# EAGLE design mc6809e_adapter (EAGLE 5.12)
REVISION: 20120726
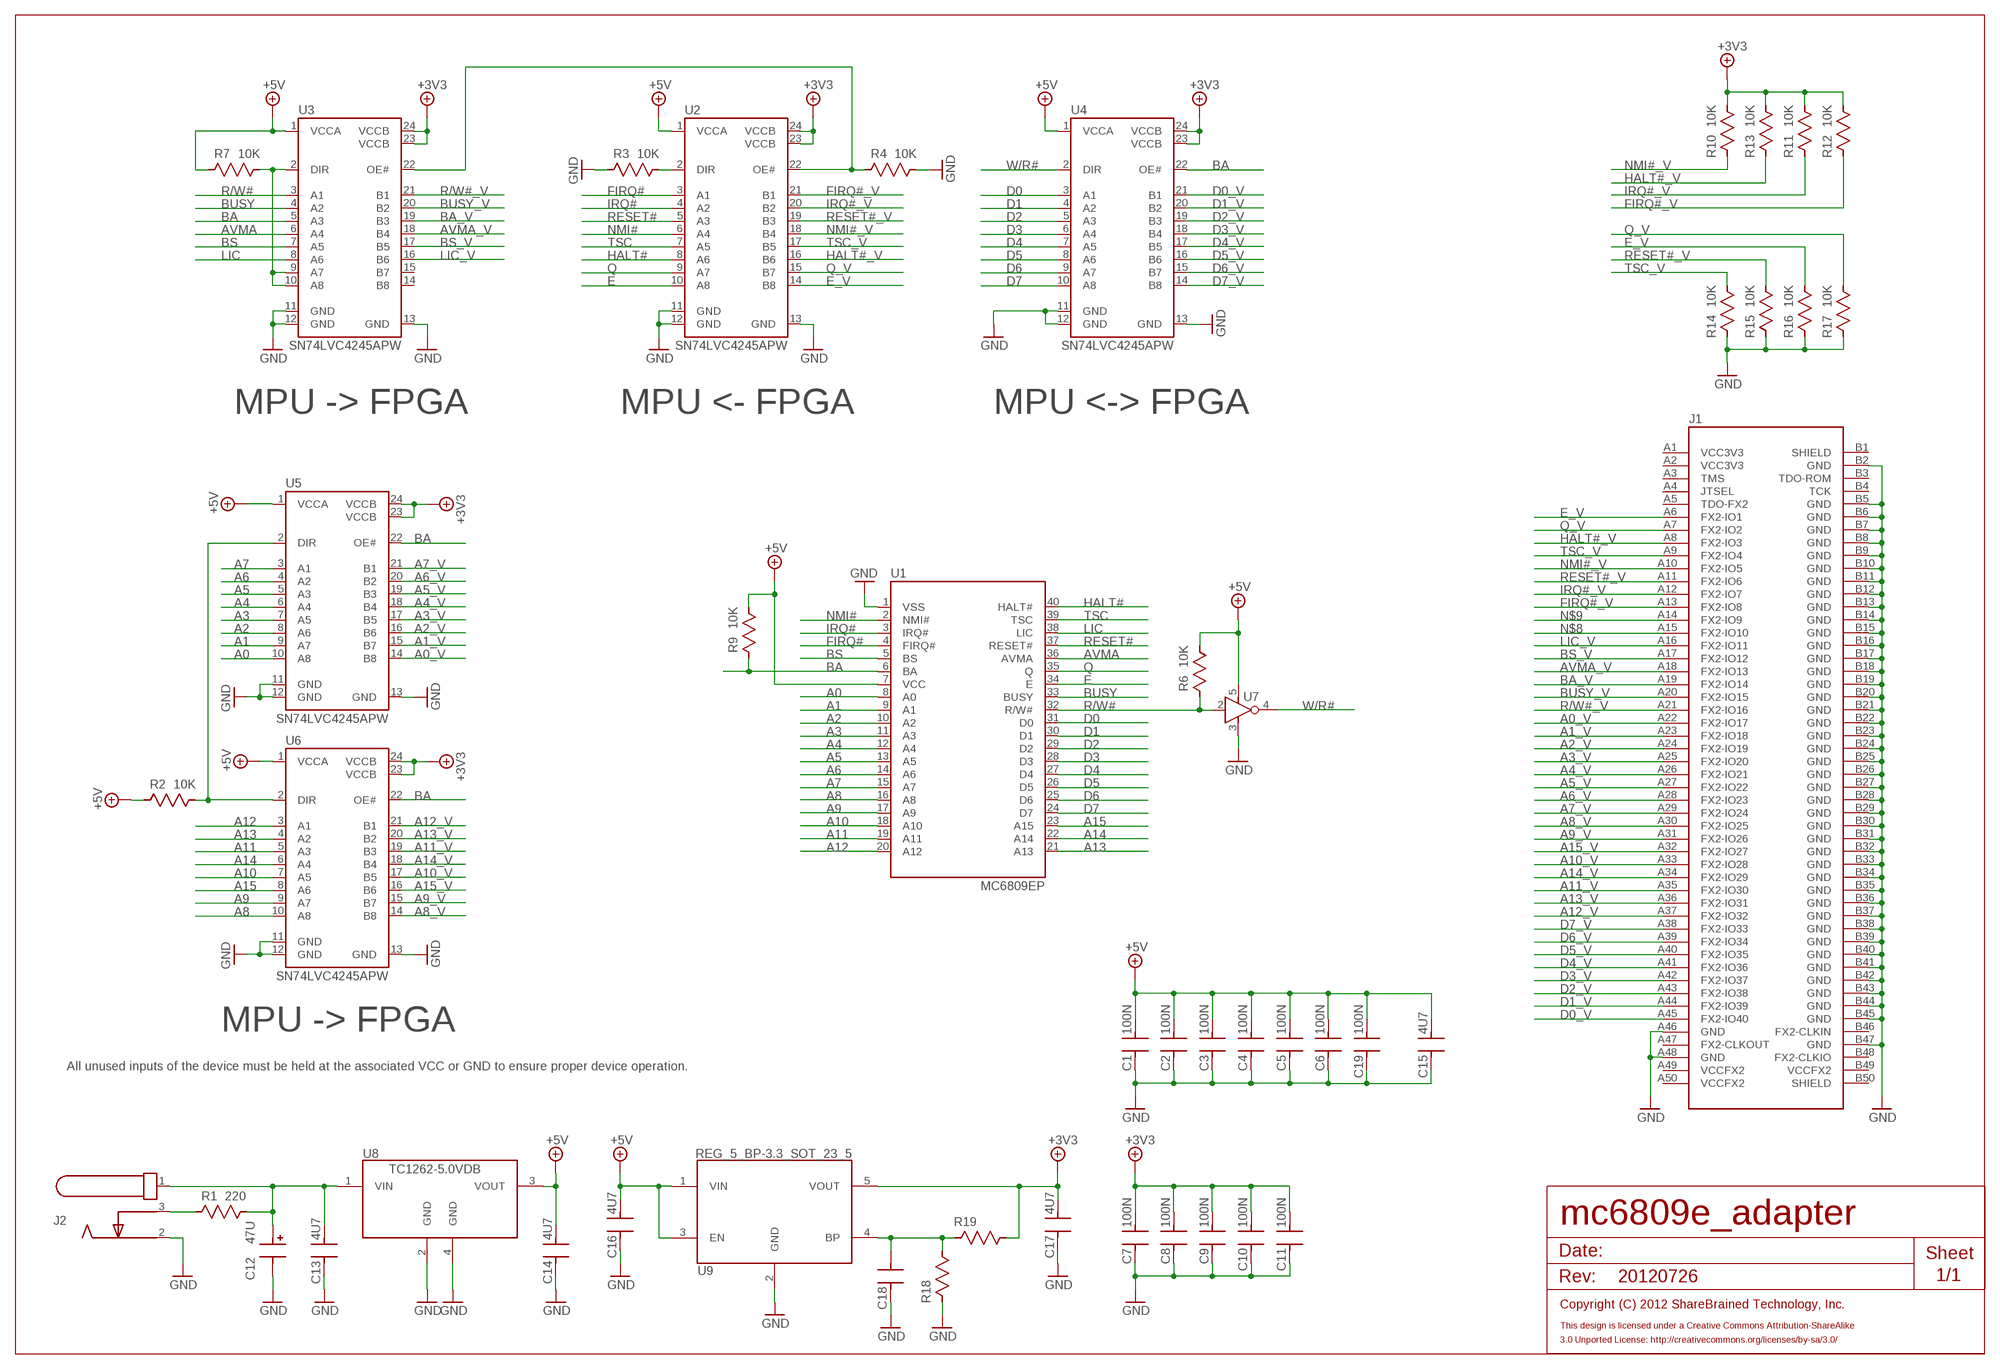
[diagram p0: schematic, sheet 1]

## Parts
C1  100N  C0603_90  [CAPC1608X90N]
C2  100N  C0603_90  [CAPC1608X90N]
C3  100N  C0603_90  [CAPC1608X90N]
C4  100N  C0603_90  [CAPC1608X90N]
C5  100N  C0603_90  [CAPC1608X90N]
C6  100N  C0603_90  [CAPC1608X90N]
C7  100N  C0603_90  [CAPC1608X90N]
C8  100N  C0603_90  [CAPC1608X90N]
C9  100N  C0603_90  [CAPC1608X90N]
C10  100N  C0603_90  [CAPC1608X90N]
C11  100N  C0603_90  [CAPC1608X90N]
C12  47U  CPOL7343-43  [CAPMP7343X430N]
C13  4U7  C0805_135  [CAPC2012X135N]
C14  4U7  C0805_135  [CAPC2012X135N]
C15  4U7  C0805_135  [CAPC2012X135N]
C16  4U7  C0805_135  [CAPC2012X135N]
C17  4U7  C0805_135  [CAPC2012X135N]
C18  C0603_90  [CAPC1608X90N]
C19  100N  C0603_90  [CAPC1608X90N]
J1  NEXYS2_SMALL  [HIROSE_FX2-100S-1.27DS]
J2  DC_3_CUI_PJ102A  [CUI_PJ_102A]
R1  220  R0603_55  [RESC1608X55N]
R2  10K  R0603_55  [RESC1608X55N]
R3  10K  R0603_55  [RESC1608X55N]
R4  10K  R0603_55  [RESC1608X55N]
R6  10K  R0603_55  [RESC1608X55N]
R7  10K  R0603_55  [RESC1608X55N]
R9  10K  R0603_55  [RESC1608X55N]
R10  10K  R0603_55  [RESC1608X55N]
R11  10K  R0603_55  [RESC1608X55N]
R12  10K  R0603_55  [RESC1608X55N]
R13  10K  R0603_55  [RESC1608X55N]
R14  10K  R0603_55  [RESC1608X55N]
R15  10K  R0603_55  [RESC1608X55N]
R16  10K  R0603_55  [RESC1608X55N]
R17  10K  R0603_55  [RESC1608X55N]
R18  R0603_55  [RESC1608X55N]
R19  R0603_55  [RESC1608X55N]
U1  MC6809EP  [DIP40]
U2  SN74LVC4245APW  [SOP65P640X120-24N]
U3  SN74LVC4245APW  [SOP65P640X120-24N]
U4  SN74LVC4245APW  [SOP65P640X120-24N]
U5  SN74LVC4245APW  [SOP65P640X120-24N]
U6  SN74LVC4245APW  [SOP65P640X120-24N]
U7  SN74LVC1G14DCK  [SOT65P210X110-5N]
U8  TC1262-5.0VDB  [SOT223-3]
U9  REG_5_BP-3.3_SOT_23_5  [SOT95P280X110-5N]

## Nets
+3V3: C7.2 C8.2 C9.2 C10.2 C11.2 C17.2 R10.2 R11.2 R12.2 R13.2 R19.2 U2.23(VCCB) U2.24(VCCB) U3.23(VCCB) U3.24(VCCB) U4.23(VCCB) U4.24(VCCB) U5.23(VCCB) U5.24(VCCB) U6.23(VCCB) U6.24(VCCB) U9.5(VOUT)
+5V: C1.2 C2.2 C3.2 C4.2 C5.2 C6.2 C14.2 C15.2 C16.2 C19.2 R2.1 R6.2 R7.1 R9.2 U1.7(VCC) U2.1(VCCA) U3.1(VCCA) U4.1(VCCA) U5.1(VCCA) U6.1(VCCA) U7.5(VCC) U8.3(VOUT) U9.1(VIN) U9.3(EN)
A0: U1.8(A0) U5.10(A8)
A0_V: J1.A22(FX2-IO17) U5.14(B8)
A1: U1.9(A1) U5.9(A7)
A1_V: J1.A23(FX2-IO18) U5.15(B7)
A2: U1.10(A2) U5.8(A6)
A2_V: J1.A24(FX2-IO19) U5.16(B6)
A3: U1.11(A3) U5.7(A5)
A3_V: J1.A25(FX2-IO20) U5.17(B5)
A4: U1.12(A4) U5.6(A4)
A4_V: J1.A26(FX2-IO21) U5.18(B4)
A5: U1.13(A5) U5.5(A3)
A5_V: J1.A27(FX2-IO22) U5.19(B3)
A6: U1.14(A6) U5.4(A2)
A6_V: J1.A28(FX2-IO23) U5.20(B2)
A7: U1.15(A7) U5.3(A1)
A7_V: J1.A29(FX2-IO24) U5.21(B1)
A8: U1.16(A8) U6.10(A8)
A8_V: J1.A30(FX2-IO25) U6.14(B8)
A9: U1.17(A9) U6.9(A7)
A9_V: J1.A31(FX2-IO26) U6.15(B7)
A10: U1.18(A10) U6.7(A5)
A10_V: J1.A33(FX2-IO28) U6.17(B5)
A11: U1.19(A11) U6.5(A3)
A11_V: J1.A35(FX2-IO30) U6.19(B3)
A12: U1.20(A12) U6.3(A1)
A12_V: J1.A37(FX2-IO32) U6.21(B1)
A13: U1.21(A13) U6.4(A2)
A13_V: J1.A36(FX2-IO31) U6.20(B2)
A14: U1.22(A14) U6.6(A4)
A14_V: J1.A34(FX2-IO29) U6.18(B4)
A15: U1.23(A15) U6.8(A6)
A15_V: J1.A32(FX2-IO27) U6.16(B6)
AVMA: U1.36(AVMA) U3.6(A4)
AVMA_V: J1.A18(FX2-IO13) U3.18(B4)
BA: R9.1 U1.6(BA) U3.5(A3) U4.22(OE#) U5.22(OE#) U6.22(OE#)
BA_V: J1.A19(FX2-IO14) U3.19(B3)
BS: U1.5(BS) U3.7(A5)
BS_V: J1.A17(FX2-IO12) U3.17(B5)
BUSY: U1.33(BUSY) U3.4(A2)
BUSY_V: J1.A20(FX2-IO15) U3.20(B2)
D0: U1.31(D0) U4.3(A1)
D0_V: J1.A45(FX2-IO40) U4.21(B1)
D1: U1.30(D1) U4.4(A2)
D1_V: J1.A44(FX2-IO39) U4.20(B2)
D2: U1.29(D2) U4.5(A3)
D2_V: J1.A43(FX2-IO38) U4.19(B3)
D3: U1.28(D3) U4.6(A4)
D3_V: J1.A42(FX2-IO37) U4.18(B4)
D4: U1.27(D4) U4.7(A5)
D4_V: J1.A41(FX2-IO36) U4.17(B5)
D5: U1.26(D5) U4.8(A6)
D5_V: J1.A40(FX2-IO35) U4.16(B6)
D6: U1.25(D6) U4.9(A7)
D6_V: J1.A39(FX2-IO34) U4.15(B7)
D7: U1.24(D7) U4.10(A8)
D7_V: J1.A38(FX2-IO33) U4.14(B8)
E: U1.34(E) U2.10(A8)
E_V: J1.A6(FX2-IO1) R16.2 U2.14(B8)
FIRQ#: U1.4(FIRQ#) U2.3(A1)
FIRQ#_V: J1.A13(FX2-IO8) R12.1 U2.21(B1)
GND: C1.1 C2.1 C3.1 C4.1 C5.1 C6.1 C7.1 C8.1 C9.1 C10.1 C11.1 C12.2 C13.1 C14.1 C15.1 C16.1 C17.1 C18.1 C19.1 J1.A46(GND) J1.A48(GND) J1.B2(GND) J1.B5(GND) J1.B6(GND) J1.B7(GND) J1.B8(GND) J1.B9(GND) J1.B10(GND) J1.B11(GND) J1.B12(GND) J1.B13(GND) J1.B14(GND) J1.B15(GND) J1.B16(GND) J1.B17(GND) J1.B18(GND) J1.B19(GND) J1.B20(GND) J1.B21(GND) J1.B22(GND) J1.B23(GND) J1.B24(GND) J1.B25(GND) J1.B26(GND) J1.B27(GND) J1.B28(GND) J1.B29(GND) J1.B30(GND) J1.B31(GND) J1.B32(GND) J1.B33(GND) J1.B34(GND) J1.B35(GND) J1.B36(GND) J1.B37(GND) J1.B38(GND) J1.B39(GND) J1.B40(GND) J1.B41(GND) J1.B42(GND) J1.B43(GND) J1.B44(GND) J1.B45(GND) J1.B47(GND) J2.2 R3.1 R4.2 R14.1 R15.1 R16.1 R17.1 R18.1 U1.1(VSS) U2.11(GND) U2.12(GND) U2.13(GND) U3.11(GND) U3.12(GND) U3.13(GND) U4.11(GND) U4.12(GND) U4.13(GND) U5.11(GND) U5.12(GND) U5.13(GND) U6.11(GND) U6.12(GND) U6.13(GND) U7.3(GND) U8.2(GND) U8.4(GND) U9.2(GND)
HALT#: U1.40(HALT#) U2.8(A6)
HALT#_V: J1.A8(FX2-IO3) R13.1 U2.16(B6)
IRQ#: U1.3(IRQ#) U2.4(A2)
IRQ#_V: J1.A12(FX2-IO7) R11.1 U2.20(B2)
LIC: U1.38(LIC) U3.8(A6)
LIC_V: J1.A16(FX2-IO11) U3.16(B6)
N$1: R3.2 U2.2(DIR)
N$2: C18.2 R18.2 R19.1 U9.4(BP)
N$8: J1.A15(FX2-IO10)
N$9: J1.A14(FX2-IO9)
N$49: R2.2 U5.2(DIR) U6.2(DIR)
N$60: R4.1 U2.22(OE#) U3.22(OE#)
N$69: R7.2 U3.2(DIR) U3.9(A7) U3.10(A8)
N$84: J2.3 R1.1
N$85: C12.1 C13.2 J2.1 R1.2 U8.1(VIN)
NMI#: U1.2(NMI#) U2.6(A4)
NMI#_V: J1.A10(FX2-IO5) R10.1 U2.18(B4)
Q: U1.35(Q) U2.9(A7)
Q_V: J1.A7(FX2-IO2) R17.2 U2.15(B7)
R/W#: R6.1 U1.32(R/W#) U3.3(A1) U7.2(A)
R/W#_V: J1.A21(FX2-IO16) U3.21(B1)
RESET#: U1.37(RESET#) U2.5(A3)
RESET#_V: J1.A11(FX2-IO6) R15.2 U2.19(B3)
TSC: U1.39(TSC) U2.7(A5)
TSC_V: J1.A9(FX2-IO4) R14.2 U2.17(B5)
W/R#: U4.2(DIR) U7.4(Y)
Unconnected: J1.A1(VCC3V3) J1.A2(VCC3V3) J1.A3(TMS) J1.A4(JTSEL) J1.A5(TDO-FX2) J1.A47(FX2-CLKOUT) J1.A49(VCCFX2) J1.A50(VCCFX2) J1.B1(SHIELD) J1.B3(TDO-ROM) J1.B4(TCK) J1.B46(FX2-CLKIN) J1.B48(FX2-CLKIO) J1.B49(VCCFX2) J1.B50(SHIELD) U3.14(B8) U3.15(B7)

## Notes on the sheet
- MPU -> FPGA | MPU <- FPGA | MPU <-> FPGA
- MPU -> FPGA
- All unused inputs of the device must be held at the associated VCC or GND to ensure proper device operation.

## Library data of the parts
C1-C11 C13-C19 = capacitor:C
C12 = capacitor:CPOL
J1 = digilent:NEXYS2_SMALL
J2 = dc_connector:DC_3
R1-R4 R6 R7 R9-R19 = resistor:R
U1 = motorola:MC68*09E?
U2-U6 = ti:SN74LVC4245A
U7 = ti:SN74LVC1G14
U8 = microchip:TC1262-*
U9 = regulator:REG_5_BP-*

## Board
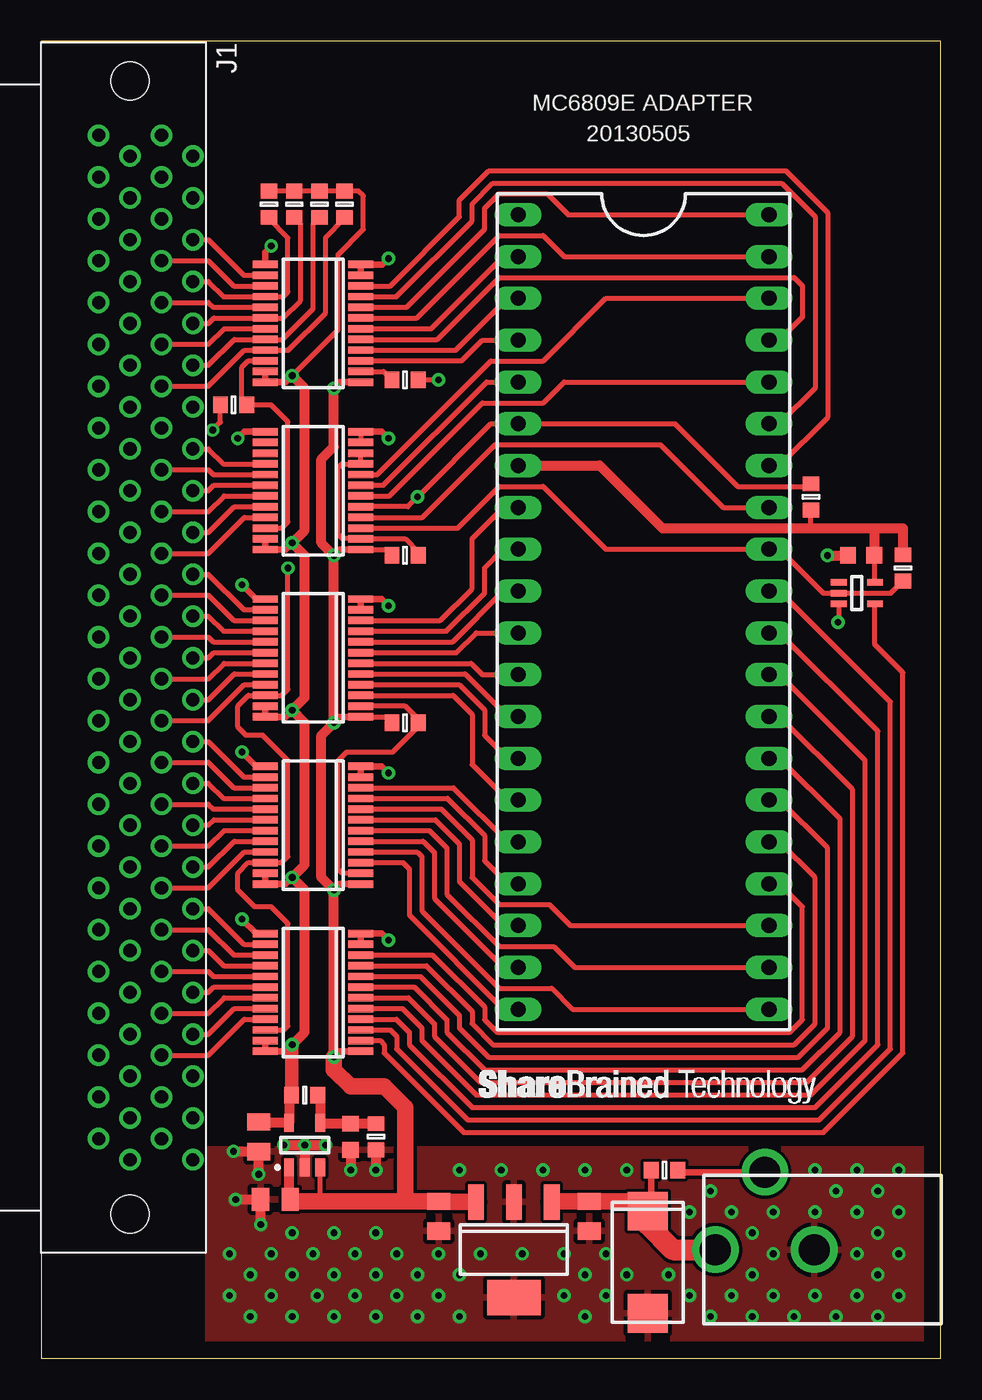
[diagram p1: board, top side]
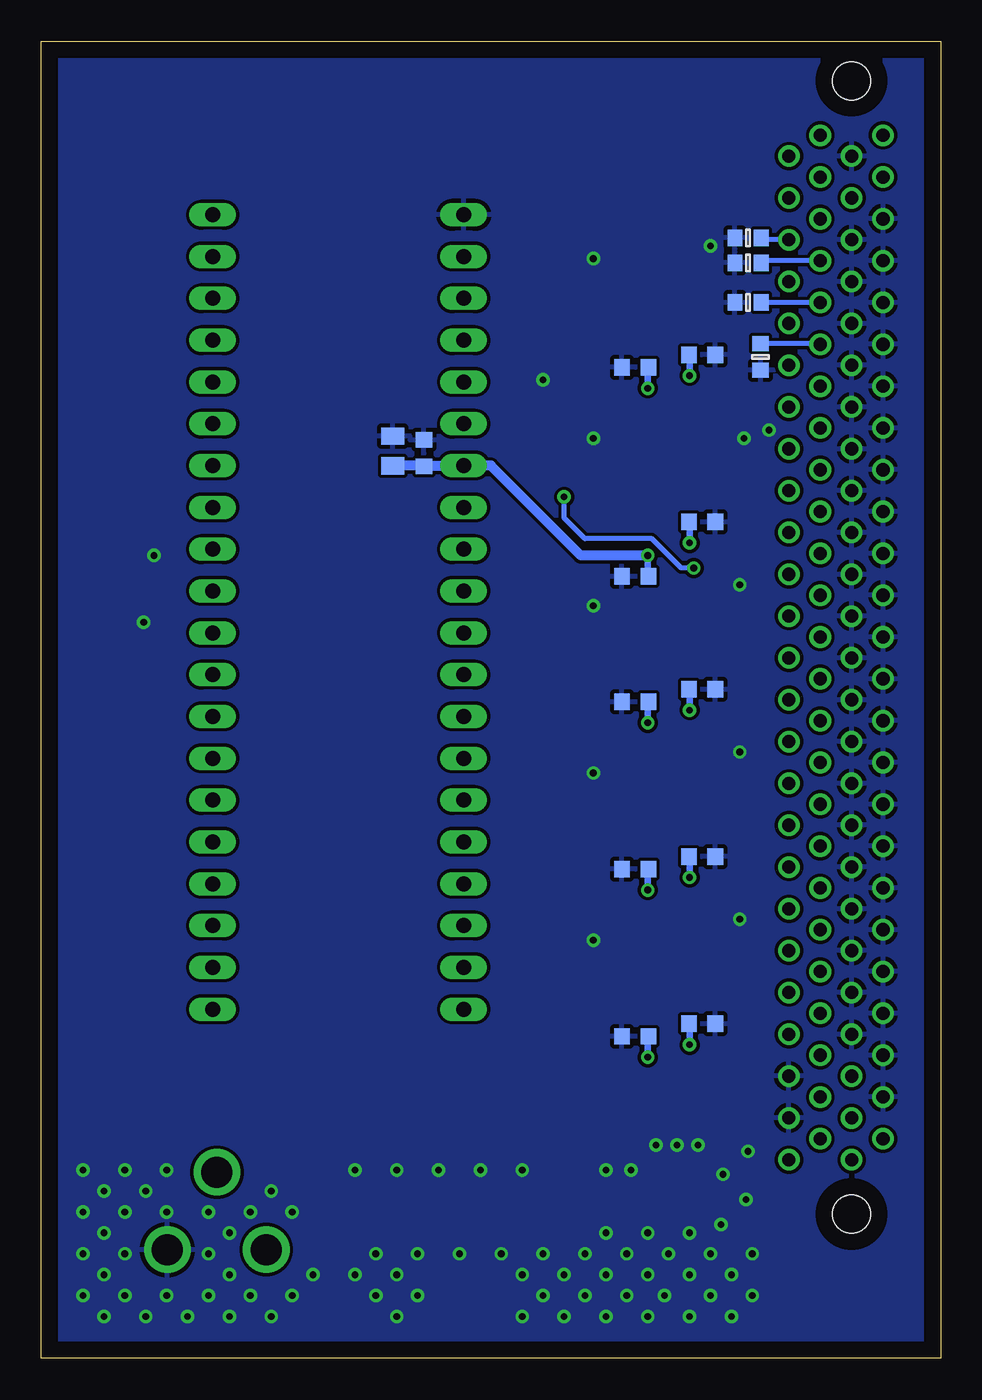
[diagram p2: board, bottom side, seen from below]

Size 54.61 x 80.01 mm. Coordinates in mm from the lower left corner, seen from the top.
Outline: 0,0 54.61,0 54.61,80.01 0,80.01 0,0
Copper layers (1*16): Top 0.035mm / dielectric 1.5mm / Bottom 0.035mm
Design rules "default *": minimum track width 12mil, minimum drill 16mil, track to track 8mil, track to pad 8mil, pad to pad 8mil, via to via 8mil, smd to smd 8mil, copper to edge 40mil, drill to drill 20mil, minimum pad ring 10mil, minimum via ring 8mil, stop-mask expansion 4mil, vias tented up to drill 16mil, thermal gap 10mil

### Footprints (pad centres in the part's own frame; a part is rotated, then mirrored left to right if it is on the bottom)
CAPC1608X90N = smd 0.95 x 1: 1 -0.8,0; 2 0.8,0
CAPMP7343X430N = smd 2.35 x 2.45: 1 -3.1,0; 2 3.1,0
CAPC2012X135N = smd 1.05 x 1.4: 1 -0.9,0; 2 0.9,0
HIROSE_FX2-100S-1.27DS = drill 0.8 round: A1 31.115,-0.953; A2 29.845,-2.857; A3 28.575,-0.953; A4 27.305,-2.857; A5 26.035,-0.953; A6 24.765,-2.857; A7 23.495,-0.953; A8 22.225,-2.857; A9 20.955,-0.953; A10 19.685,-2.857; A11 18.415,-0.953; A12 17.145,-2.857; A13 15.875,-0.953; A14 14.605,-2.857; A15 13.335,-0.953; A16 12.065,-2.857; A17 10.795,-0.953; A18 9.525,-2.857; A19 8.255,-0.953; A20 6.985,-2.857; A21 5.715,-0.953; A22 4.445,-2.857; A23 3.175,-0.953; A24 1.905,-2.857; A25 0.635,-0.953; A26 -0.635,-2.857; A27 -1.905,-0.953; A28 -3.175,-2.857; A29 -4.445,-0.953; A30 -5.715,-2.857; A31 -6.985,-0.953; A32 -8.255,-2.857; A33 -9.525,-0.953; A34 -10.795,-2.857; A35 -12.065,-0.953; A36 -13.335,-2.857; A37 -14.605,-0.953; A38 -15.875,-2.857; A39 -17.145,-0.953; A40 -18.415,-2.857; A41 -19.685,-0.953; A42 -20.955,-2.857; A43 -22.225,-0.953; A44 -23.495,-2.857; A45 -24.765,-0.953; A46 -26.035,-2.857; A47 -27.305,-0.953; A48 -28.575,-2.857; A49 -29.845,-0.953; A50 -31.115,-2.857; B1 31.115,2.857; B2 29.845,0.953; B3 28.575,2.857; B4 27.305,0.953; B5 26.035,2.857; B6 24.765,0.953; B7 23.495,2.857; B8 22.225,0.953; B9 20.955,2.857; B10 19.685,0.953; B11 18.415,2.857; B12 17.145,0.953; B13 15.875,2.857; B14 14.605,0.953; B15 13.335,2.857; B16 12.065,0.953; B17 10.795,2.857; B18 9.525,0.953; B19 8.255,2.857; B20 6.985,0.953; B21 5.715,2.857; B22 4.445,0.953; B23 3.175,2.857; B24 1.905,0.953; B25 0.635,2.857; B26 -0.635,0.953; B27 -1.905,2.857; B28 -3.175,0.953; B29 -4.445,2.857; B30 -5.715,0.953; B31 -6.985,2.857; B32 -8.255,0.953; B33 -9.525,2.857; B34 -10.795,0.953; B35 -12.065,2.857; B36 -13.335,0.953; B37 -14.605,2.857; B38 -15.875,0.953; B39 -17.145,2.857; B40 -18.415,0.953; B41 -19.685,2.857; B42 -20.955,0.953; B43 -22.225,2.857; B44 -23.495,0.953; B45 -24.765,2.857; B46 -26.035,0.953; B47 -27.305,2.857; B48 -28.575,0.953; B49 -29.845,2.857; B50 -31.115,0.953 | hole 2.3: 34.425,0.953; -34.425,0.953
CUI_PJ_102A = drill 1.887 round: 1 0,-3; 2 0,3; 3 -4.7,0
RESC1608X55N = smd 0.9 x 1: 1 -0.8,0; 2 0.8,0
DIP40 = drill 0.914 long: 1 -7.62,24.13; 2 -7.62,21.59; 3 -7.62,19.05; 4 -7.62,16.51; 5 -7.62,13.97; 6 -7.62,11.43; 7 -7.62,8.89; 8 -7.62,6.35; 9 -7.62,3.81; 10 -7.62,1.27; 11 -7.62,-1.27; 12 -7.62,-3.81; 13 -7.62,-6.35; 14 -7.62,-8.89; 15 -7.62,-11.43; 16 -7.62,-13.97; 17 -7.62,-16.51; 18 -7.62,-19.05; 19 -7.62,-21.59; 20 -7.62,-24.13; 21 7.62,-24.13; 22 7.62,-21.59; 23 7.62,-19.05; 24 7.62,-16.51; 25 7.62,-13.97; 26 7.62,-11.43; 27 7.62,-8.89; 28 7.62,-6.35; 29 7.62,-3.81; 30 7.62,-1.27; 31 7.62,1.27; 32 7.62,3.81; 33 7.62,6.35; 34 7.62,8.89; 35 7.62,11.43; 36 7.62,13.97; 37 7.62,16.51; 38 7.62,19.05; 39 7.62,21.59; 40 7.62,24.13
SOP65P640X120-24N = smd 1.5 x 0.45: 1 -2.9,3.575; 2 -2.9,2.925; 3 -2.9,2.275; 4 -2.9,1.625; 5 -2.9,0.975; 6 -2.9,0.325; 7 -2.9,-0.325; 8 -2.9,-0.975; 9 -2.9,-1.625; 10 -2.9,-2.275; 11 -2.9,-2.925; 12 -2.9,-3.575; 13 2.9,-3.575; 14 2.9,-2.925; 15 2.9,-2.275; 16 2.9,-1.625; 17 2.9,-0.975; 18 2.9,-0.325; 19 2.9,0.325; 20 2.9,0.975; 21 2.9,1.625; 22 2.9,2.275; 23 2.9,2.925; 24 2.9,3.575
SOT65P210X110-5N = smd 0.95 x 0.4: 1 -1.1,0.65; 2 -1.1,0; 3 -1.1,-0.65; 4 1.1,-0.65; 5 1.1,0.65
SOT223-3 = smd 2.15 x 0.95: 1 -2.9,2.3; 2 -2.9,0; 3 -2.9,-2.3 | smd 2.15 x 3.25: 4 2.9,0
SOT95P280X110-5N = smd 1.1 x 0.6: 1 -1.35,0.95; 2 -1.35,0; 3 -1.35,-0.95; 4 1.35,-0.95; 5 1.35,0.95

### Placement (x,y rotation side)
C1  18.54,60.2 0 bottom
C2  18.54,47.5 0 bottom
C3  18.54,39.88 0 bottom
C4  18.54,29.72 0 bottom
C5  18.54,19.56 0 bottom
C6  49.78,48.77 0 top
C7  14.48,60.96 180 bottom
C8  14.48,50.8 180 bottom
C9  14.48,40.64 180 bottom
C10  14.48,30.48 180 bottom
C11  14.48,20.32 180 bottom
C12  36.83,5.84 270 top
C13  33.27,8.64 90 top
C14  24.13,8.64 90 top
C15  33.27,55.12 270 bottom
C16  14.22,9.65 0 top
C17  13.21,13.46 90 top
C18  18.8,13.46 90 top
C19  31.37,54.99 270 bottom
J1  6.35,43.18 90 top
J2  43.94,6.6 270 top
R1  37.85,11.43 180 top
R2  22.1,38.61 0 top
R3  22.1,59.44 180 top
R4  11.68,57.91 180 top
R6  52.32,48.01 90 top
R7  22.1,48.77 0 top
R9  46.74,52.32 270 top
R10  15.37,70.1 90 top
R11  16.89,70.1 90 top
R12  18.41,70.1 90 top
R13  13.84,70.1 90 top
R14  11.68,64.13 0 bottom
R15  10.92,60.83 90 bottom
R16  11.68,68.07 0 bottom
R17  11.68,66.55 0 bottom
R18  20.32,13.46 90 top
R19  16,16 180 top
U1  36.58,45.34 0 top
U2  16.51,62.87 180 top
U3  16.51,52.7 180 top
U4  16.51,22.23 180 top
U5  16.51,42.55 180 top
U6  16.51,32.38 180 top
U7  49.53,46.48 0 top
U8  28.7,6.6 270 top
U9  16,12.95 90 top
U$2  [NAME_750_1000]  26.49,15.37 0 top

### Tracks (layer width: path | path; a pad name or v marks a point on that pad's centre or on a via)
+3V3  (via drill 0.41)
  Top 0.305: R13.2 R10.2 R11.2 R12.2 19.27,70.9 19.56,70.61 19.56,68.58 18.03,67.06 18.03,62.48 v15.24,59.69
  Top 0.406: U2.23 U2.24 14.84,59.29 v15.24,59.69 | U3.23 U3.24 14.84,49.13 v15.24,49.53 | v15.24,39.37 14.84,38.97 U5.24 U5.23 | v15.24,29.21 14.84,28.81 U6.24 U6.23 | v15.24,19.05 14.84,18.65 U4.24 U4.23
  Top 0.61: v15.24,59.69 16,58.93 16,50.29 v15.24,49.53 16,48.77 16,40.13 v15.24,39.37 16,38.61 16,29.97 v15.24,29.21 16,28.45 16,19.81 v15.24,19.05 v15.25,19.04 | C17.2 13.27,14.3 U9.5 15.05,15.85 R19.2
  Top 0.813: R19.2 15.2,19.01 v15.24,19.05
  Bottom 0.406: v15.24,49.53 15.24,50.76 C8.2 | v15.24,59.69 15.24,60.92 C7.2 | v15.24,39.37 15.24,40.6 C9.2 | v15.24,29.21 15.24,30.44 C10.2 | v15.24,19.05 15.24,20.28 C11.2
+5V  (via drill 0.41)
  Top 0.305: C6.2 50.58,47.18 U7.5 | 46.74,50.42 R9.2 | U3.1 20.94,49.13 R7.1 | U5.1 20.94,38.97 R2.1 | U9.3 16.95,9.6 17.02,9.54
  Top 0.406: U2.1 18.14,59.29 v17.78,58.93 | U3.1 18.14,49.13 v17.78,48.77 | U5.1 18.14,38.97 v17.78,38.61 | U6.1 18.14,28.81 v17.78,28.45 | U4.1 18.14,18.65 v17.78,18.29
  Top 0.61: U1.7 33.91,54.23 37.72,50.42 46.74,50.42 50.55,50.42 | 50.55,50.42 52.32,50.42 R6.2 | C6.2 50.58,50.38 50.55,50.42 | v17.78,58.93 17.78,55.37 17.02,54.61 17.02,49.53 v17.78,48.77 v17.78,38.61 17.02,37.85 17.02,29.21 v17.78,28.45 v17.78,18.29 | U9.1 15.05,9.72 C16.2
  Top 1.016: U8.3 24.16,9.5 C14.2 22.1,9.54 | 22.1,9.54 17.02,9.54 15.24,9.54 C16.2 | v17.78,18.29 17.78,17.53 18.8,16.51 20.83,16.51 22.1,15.24 22.1,9.54
  Bottom 0.406: v17.78,58.93 17.78,60.16 C1.2 | v17.78,38.61 17.78,39.84 C3.2 | v17.78,28.45 17.78,29.68 C4.2 | v17.78,18.29 17.78,19.52 C5.2 | v17.78,48.77 17.78,47.54 C2.2
  Bottom 0.61: v17.78,48.77 21.84,48.77 27.3,54.23 U1.7 28.99,54.19 C19.2 31.4,54.22 C15.2
A0
  Top 0.305: U1.8 28.07,51.69 26.16,49.78 26.16,46.74 24.25,44.82 U5.10
A0_V
  Top 0.305: J1.A22 10.16,47.62 12.31,45.47 U5.14
A1
  Top 0.305: U1.9 28.07,49.15 26.92,48.01 26.92,46.48 24.61,44.17 U5.9
A1_V
  Top 0.305: J1.A23 10.16,46.36 11.7,44.82 U5.15
A2
  Top 0.305: U1.10 28.07,46.61 24.98,43.52 U5.8
A2_V
  Top 0.305: J1.A24 10.16,45.09 11.07,44.17 U5.16
A3
  Top 0.305: U1.11 26.42,44.07 25.22,42.87 U5.7
A3_V
  Top 0.305: J1.A25 10.16,43.82 10.46,43.52 U5.17
A4
  Top 0.305: U5.6 26.11,42.22 26.8,41.53 U1.12
A4_V
  Top 0.305: J1.A26 10.16,42.55 10.48,42.87 U5.18
A5
  Top 0.305: U1.13 28.32,38.99 25.74,41.57 U5.5
A5_V
  Top 0.305: J1.A27 10.16,41.27 11.11,42.22 U5.19
A6
  Top 0.305: U5.4 25.37,40.92 26.92,39.37 26.92,37.85 28.32,36.45 U1.14
A6_V
  Top 0.305: J1.A28 10.16,40.01 11.72,41.57 U5.20
A7
  Top 0.305: U1.15 28.32,33.91 26.16,36.07 26.16,39.12 25.01,40.27 U5.3
A7_V
  Top 0.305: J1.A29 10.16,38.73 12.35,40.92 U5.21
A8
  Top 0.305: U1.16 28.32,31.37 25.03,34.66 U6.10
A8_V
  Top 0.305: J1.A30 10.16,37.46 12.31,35.31 U6.14
A9
  Top 0.305: U1.17 28.32,28.83 26.92,30.23 26.92,31.75 24.66,34.01 U6.9
A9_V
  Top 0.305: J1.A31 10.16,36.2 11.7,34.66 U6.15
A10
  Top 0.305: U1.18 28.07,26.29 25.4,28.96 25.4,31.24 23.93,32.71 U6.7
A10_V
  Top 0.305: J1.A33 10.16,33.66 10.46,33.36 U6.17
A11
  Top 0.305: U1.19 28.07,23.75 23.88,27.94 23.88,30.73 23.2,31.41 U6.5
A11_V
  Top 0.305: J1.A35 10.16,31.12 11.11,32.06 U6.19
A12
  Top 0.305: U1.20 28.07,21.21 22.35,26.92 22.35,29.72 21.96,30.11 U6.3
A12_V
  Top 0.305: J1.A37 10.16,28.58 12.35,30.76 U6.21
A13
  Top 0.305: U1.21 32.26,21.21 30.99,22.48 27.81,22.48 23.11,27.18 23.11,30.48 22.83,30.76 U6.4
A13_V
  Top 0.305: J1.A36 10.16,29.84 11.72,31.41 U6.20
A14
  Top 0.305: U1.22 32.38,23.75 31.11,25.02 27.81,25.02 24.64,28.19 24.64,30.99 23.57,32.06 U6.6
A14_V
  Top 0.305: J1.A34 10.16,32.38 10.48,32.71 U6.18
A15
  Top 0.305: U1.23 32.13,26.29 30.86,27.56 27.81,27.56 26.16,29.21 26.16,31.5 24.3,33.36 U6.8
A15_V
  Top 0.305: J1.A32 10.16,34.92 11.07,34.01 U6.16
AVMA
  Top 0.305: U1.36 31.75,59.31 30.48,58.04 26.8,58.04 21.14,52.38 U3.6
AVMA_V
  Top 0.305: J1.A18 10.16,52.7 10.48,53.03 U3.18
BA  (via drill 0.41)
  Top 0.305: R9.1 46.57,52.96 42.29,52.96 38.48,56.77 U1.6 27.3,56.77 v22.86,52.32 22.27,51.73 U3.5 | U4.22 14.74,19.95 14.99,20.19 14.99,26.42 13.97,27.43 12.95,27.43 11.94,28.45 11.94,29.46 12.58,30.11 U6.22 14.62,30.11 14.99,30.48 14.99,36.32 13.46,37.85 12.45,37.85 11.94,38.35 11.94,39.62 12.58,40.27 U5.22 14.62,40.27 14.99,40.64 v14.99,48.01
  Bottom 0.305: v14.99,48.01 15.75,48.01 17.53,49.78 21.59,49.78 22.86,51.05 v22.86,52.32
BA_V
  Top 0.305: J1.A19 10.16,51.44 11.11,52.38 U3.19
BS
  Top 0.305: U1.5 27.05,59.31 20.77,53.03 U3.7
BS_V
  Top 0.305: J1.A17 10.16,53.98 10.46,53.68 U3.17
BUSY
  Top 0.305: U1.33 41.4,51.69 37.59,55.5 27.56,55.5 23.14,51.08 U3.4
BUSY_V
  Top 0.305: J1.A20 10.16,50.16 11.72,51.73 U3.20
D0
  Top 0.305: U4.3 21.2,19.95 21.59,19.56 21.59,18.8 25.91,14.48 47.24,14.48 51.56,18.8 51.56,39.88 44.83,46.61 U1.31
D0_V
  Top 0.305: J1.A45 10.16,18.41 12.35,20.6 U4.21
D1
  Top 0.305: U4.4 21.56,20.6 22.35,19.81 22.35,19.05 26.16,15.24 46.99,15.24 50.8,19.05 50.8,38.1 44.83,44.07 U1.30
D1_V
  Top 0.305: J1.A44 10.16,19.69 11.72,21.25 U4.20
D2
  Top 0.305: U4.5 21.93,21.25 23.11,20.07 23.11,19.3 26.42,16 46.74,16 50.04,19.3 50.04,36.32 44.83,41.53 U1.29
D2_V
  Top 0.305: J1.A43 10.16,20.95 11.11,21.9 U4.19
D3
  Top 0.305: U4.6 22.3,21.9 23.88,20.32 23.88,19.56 26.67,16.76 46.48,16.76 49.28,19.56 49.28,34.54 44.83,38.99 U1.28
D3_V
  Top 0.305: J1.A42 10.16,22.23 10.48,22.55 U4.18
D4
  Top 0.305: U4.7 22.66,22.55 24.64,20.57 24.64,19.81 26.92,17.53 46.23,17.53 48.51,19.81 48.51,32.77 44.83,36.45 U1.27
D4_V
  Top 0.305: J1.A41 10.16,23.49 10.46,23.2 U4.17
D5
  Top 0.305: U4.8 23.03,23.2 25.4,20.83 25.4,20.07 27.18,18.29 45.97,18.29 47.75,20.07 47.75,30.99 44.83,33.91 U1.26
D5_V
  Top 0.305: J1.A40 10.16,24.77 11.07,23.85 U4.16
D6
  Top 0.305: U4.9 23.39,23.85 26.16,21.08 26.16,20.32 27.43,19.05 45.72,19.05 46.99,20.32 46.99,29.21 44.83,31.37 U1.25
D6_V
  Top 0.305: J1.A39 10.16,26.03 11.7,24.5 U4.15
D7
  Top 0.305: U4.10 23.76,24.5 26.92,21.34 26.92,20.57 27.69,19.81 45.47,19.81 46.23,20.57 46.23,27.43 44.83,28.83 U1.24
D7_V
  Top 0.305: J1.A38 10.16,27.3 12.31,25.15 U4.14
E
  Top 0.305: U1.34 44.83,54.23 47.75,57.15 47.75,69.6 45.21,72.14 27.18,72.14 25.4,70.36 25.4,69.34 21.2,65.14 U2.10
E_V
  Top 0.305: J1.A6 10.16,67.94 12.31,65.79 U2.14
  Bottom 0.305: R16.2 10.76,67.94 J1.A6
FIRQ#
  Top 0.305: U2.3 25.54,60.59 26.8,61.85 U1.4
FIRQ#_V
  Top 0.305: J1.A13 10.16,59.05 12.35,61.24 U2.21 15.01,61.24 17.27,63.5 17.27,68.07 18.41,69.22 R12.1
GND  (via drill 0.41)
  Top 0.305: U3.12 U3.11 | U7.3 48.43,44.75 v48.39,44.7 | R3.1 v24.13,59.44 | R4.2 10.88,56.86 v10.41,56.39
  Top 0.406: U6.11 U6.12 20.68,35.96 v21.08,35.56 | U5.11 U5.12 20.68,46.12 v21.08,45.72 | U4.11 U4.12 20.68,25.8 v21.08,25.4 | U3.13 12.34,56.28 v11.94,55.88 | U3.12 20.68,56.28 v21.08,55.88 | v21.08,66.8 20.72,66.44 U2.12 U2.11 | U6.13 13.06,35.96 v12.19,36.83 | U4.13 13.06,25.8 v12.19,26.67 | U5.13 13.06,46.12 v12.19,46.99 | U2.13 13.61,67.2 v13.97,67.56
  Top 0.61: v47.75,48.77 C6.1 | C16.1 13.32,8.14 v13.34,8.13 | v11.81,9.65 13.34,9.65 | v16,12.95 U9.2 | v16,12.95 v17.27,12.95 | v14.73,12.95 v16,12.95 | v13.21,11.18 C17.1 | v11.68,12.57 13.21,12.57 | C18.1 v18.8,11.43 | R18.1 v20.32,11.43
  other vias: 24.13,3.81 24.13,6.35 25.4,5.08 25.4,2.54 26.67,6.35 29.21,6.35 31.75,6.35 33.02,5.08 31.75,3.81 33.02,2.54 34.29,3.81 34.29,6.35 35.56,5.08 38.1,5.08 39.37,8.89 40.64,10.16 41.91,8.89 44.45,8.89 46.99,8.89 48.26,10.16 49.53,8.89 50.8,10.16 52.07,8.89 52.07,6.35 50.8,7.62 49.53,6.35 50.8,5.08 52.07,3.81 50.8,2.54 49.53,3.81 48.26,2.54 46.99,3.81 45.72,2.54 44.45,3.81 43.18,5.08 44.45,6.35 43.18,7.62 43.18,2.54 41.91,3.81 40.64,2.54 39.37,3.81 46.99,11.43 49.53,11.43 52.07,11.43 35.56,11.43 33.02,11.43 30.48,11.43 27.94,11.43 25.4,11.43 22.86,5.08 22.86,2.54 21.59,3.81 21.59,6.35 20.32,7.62 20.32,5.08 20.32,2.54 19.05,3.81 19.05,6.35 17.78,7.62 15.24,7.62 16.51,6.35 17.78,5.08 16.76,3.81 17.78,2.54 15.24,2.54 15.24,5.08 13.97,6.35 12.7,5.08 13.97,3.81 12.7,2.54 11.43,3.81 11.43,6.35
  pour Bottom: 0,0 54.61,0 54.61,80.01 0,80.01
  pour Top: 10.16,12.7 54.61,12.7 54.61,0 10.16,0
HALT#
  Top 0.305: U1.40 32,69.47 30.73,70.74 27.81,70.74 26.92,69.85 26.92,68.58 22.18,63.84 U2.8
HALT#_V
  Top 0.305: J1.A8 10.16,65.41 11.07,64.49 U2.16 14.71,64.49 14.99,64.77 14.99,68.07 13.84,69.22 R13.1
IRQ#
  Top 0.305: U2.4 25.17,61.24 28.32,64.39 U1.3
IRQ#_V
  Top 0.305: J1.A12 10.16,60.33 11.72,61.89 U2.20 14.65,61.89 16.51,63.75 16.51,68.92 R11.1
LIC
  Top 0.305: U1.38 34.29,64.39 30.48,60.58 27.3,60.58 20.41,53.68 U3.8
LIC_V
  Top 0.305: J1.A16 10.16,55.25 11.07,54.33 U3.16
N$1
  Top 0.305: U2.2 20.79,59.94 R3.2
N$2
  Top 0.61: R19.1 16.95,15.85 U9.4 16.99,14.26 C18.2 R18.2
N$49
  Top 0.305: U5.2 22.1,39.62 22.9,38.82 R2.2 22.9,38.39 21.34,36.83 18.54,36.83 18.03,36.32 18.03,29.72 18.29,29.46 U6.2
N$60
  Top 0.305: U3.22 14.62,50.43 14.99,50.8 14.99,56.9 13.97,57.91 R4.1 12.19,58.2 12.19,60.2 12.58,60.59 U2.22
N$69
  Top 0.305: U3.10 U3.9 18.26,54.33 18.03,54.1 18.03,50.04 18.29,49.78 U3.2 | U3.2 | U3.2 22.1,49.78 22.9,48.98 R7.2
N$84
  Top 0.406: J2.3 38.77,11.3 R1.1
N$85
  Top 0.406: R1.2 37.05,9.16 C12.1
  Top 1.016: C12.1 36.24,9.54 C13.2 31.03,9.54 U8.1
  Top 1.27: C12.1 36.83,8.13 38.35,6.6 J2.1
NMI#
  Top 0.305: U2.6 23.68,62.54 28.07,66.93 U1.2
NMI#_V
  Top 0.305: J1.A10 10.16,62.87 10.48,63.19 U2.18 14.68,63.19 15.75,64.26 15.75,68.92 R10.1
Q
  Top 0.305: U1.35 44.83,56.77 46.99,58.93 46.99,69.34 44.96,71.37 27.43,71.37 26.16,70.1 26.16,69.09 21.56,64.49 U2.9
Q_V
  Top 0.305: J1.A7 10.16,66.67 11.7,65.14 U2.15
  Bottom 0.305: R17.2 10.76,66.67 J1.A7
R/W#
  Top 0.305: U3.3 25.28,50.43 27.81,52.96 30.48,52.96 34.29,49.15 U1.32 44.83,49.15 47.5,46.48 U7.2 51.6,46.48 R6.1
R/W#_V
  Top 0.305: J1.A21 10.16,48.9 12.35,51.08 U3.21
RESET#
  Top 0.305: U2.5 24.04,61.89 27.81,65.66 45.72,65.66 46.23,65.15 46.23,63.25 44.83,61.85 U1.37
RESET#_V
  Top 0.305: J1.A11 10.16,61.59 11.11,62.54 U2.19
  Bottom 0.305: R15.2 7.34,61.63 J1.A11
TSC
  Top 0.305: U1.39 31.75,66.93 30.48,68.2 27.81,68.2 22.8,63.19 U2.7
TSC_V
  Top 0.305: J1.A9 10.16,64.13 10.46,63.84 U2.17
  Bottom 0.305: J1.A9 R14.2
W/R#
  Top 0.305: U4.2 20.58,19.3 20.83,19.05 20.83,18.54 25.65,13.72 47.5,13.72 52.32,18.54 52.32,41.66 50.63,43.35 U7.4

### Text on the board
tPlace: MC6809E ADAPTER | 20130505